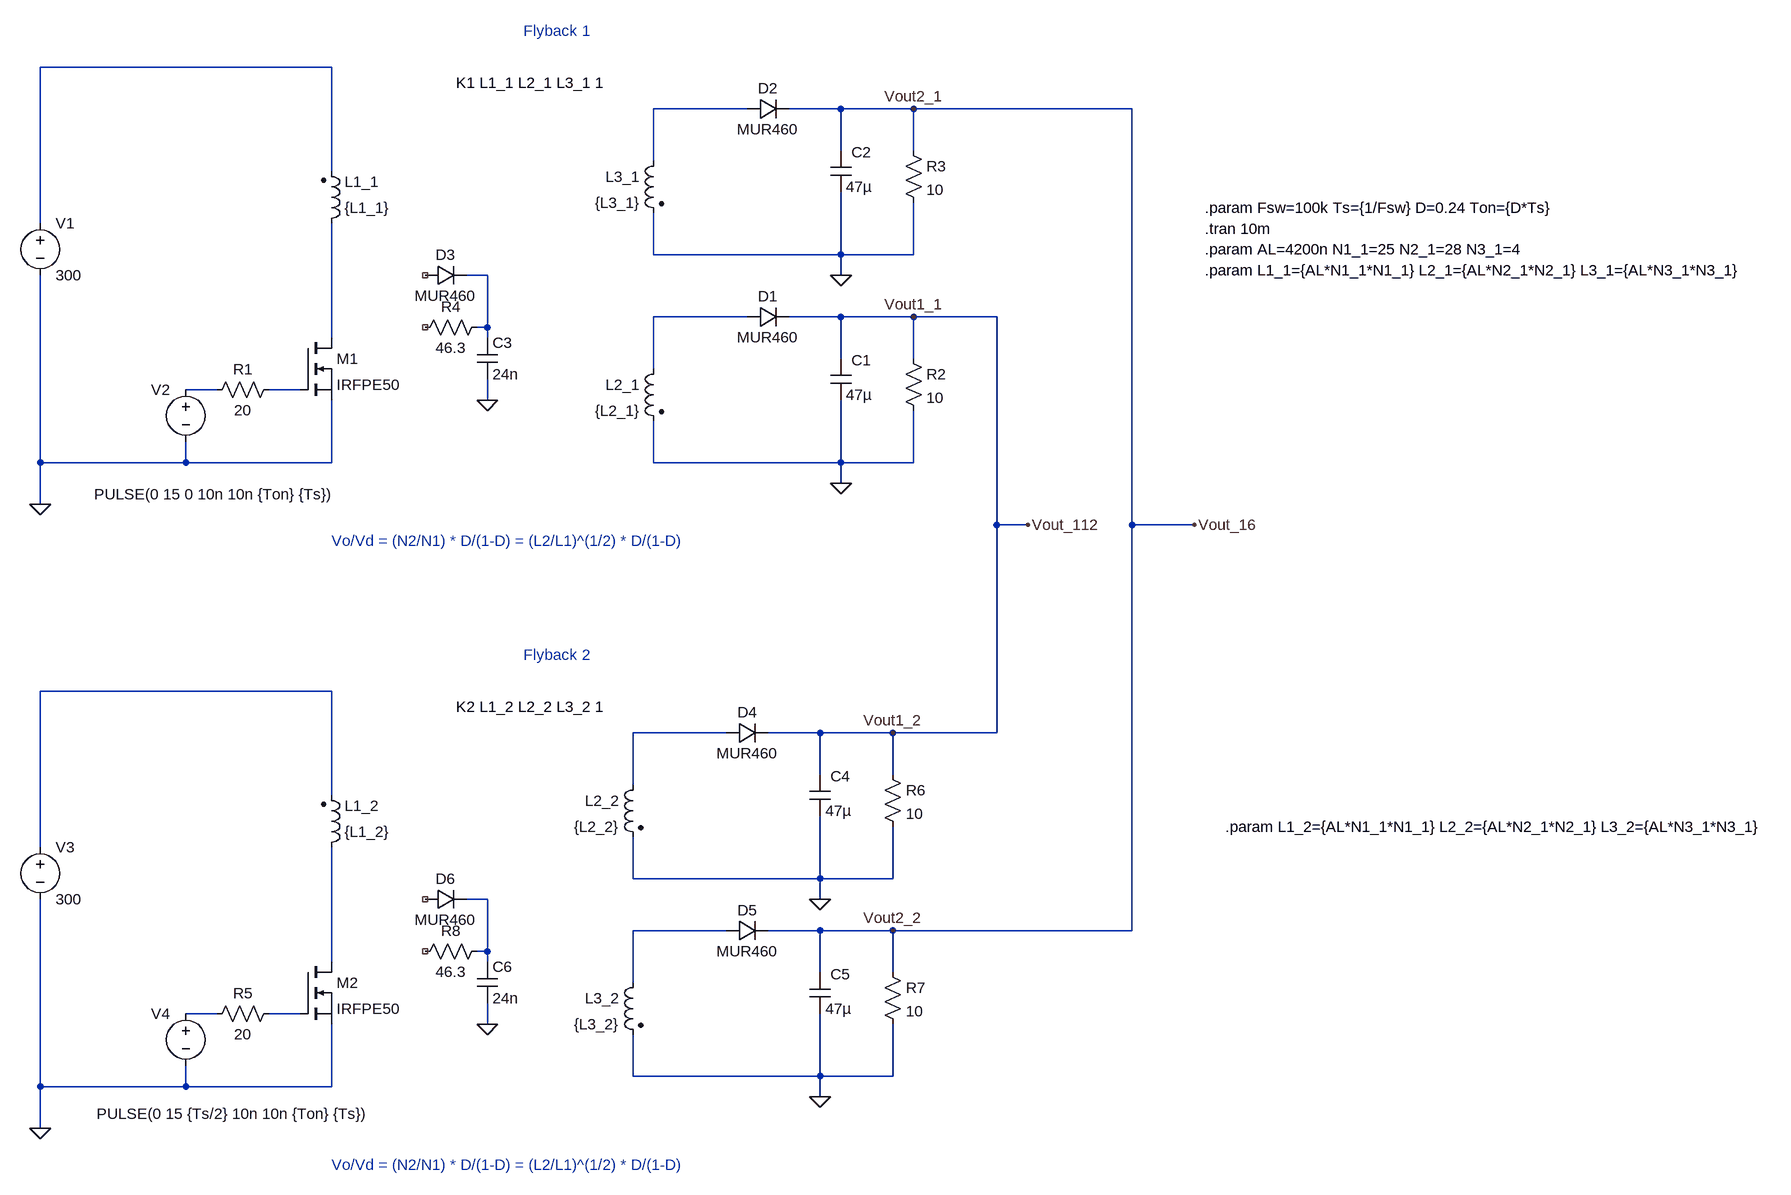
[diagram p0: schematic Flyback_2.asc]
Flyback_2.asc, the LTspice schematic file:
Version 4
SHEET 1 1892 1416
WIRE -448 -288 -896 -288
WIRE 192 -224 48 -224
WIRE 336 -224 256 -224
WIRE 448 -224 336 -224
WIRE 784 -224 448 -224
WIRE 336 -160 336 -224
WIRE 448 -160 448 -224
WIRE 48 -144 48 -224
WIRE -448 -128 -448 -288
WIRE -896 -48 -896 -288
WIRE 48 0 48 -64
WIRE 336 0 336 -96
WIRE 336 0 48 0
WIRE 448 0 448 -80
WIRE 448 0 336 0
WIRE -208 32 -240 32
WIRE 336 32 336 0
WIRE 192 96 48 96
WIRE 336 96 256 96
WIRE 448 96 336 96
WIRE 576 96 448 96
WIRE -208 112 -208 32
WIRE -208 112 -224 112
WIRE -448 128 -448 -48
WIRE -208 128 -208 112
WIRE 336 160 336 96
WIRE 448 160 448 96
WIRE 48 176 48 96
WIRE -624 208 -672 208
WIRE -496 208 -544 208
WIRE -208 224 -208 192
WIRE -896 320 -896 32
WIRE -672 320 -672 288
WIRE -672 320 -896 320
WIRE -448 320 -448 224
WIRE -448 320 -672 320
WIRE 48 320 48 256
WIRE 336 320 336 224
WIRE 336 320 48 320
WIRE 448 320 448 240
WIRE 448 320 336 320
WIRE 336 352 336 320
WIRE -896 384 -896 320
WIRE 576 416 576 96
WIRE 624 416 576 416
WIRE 784 416 784 -224
WIRE 880 416 784 416
WIRE -448 672 -896 672
WIRE 160 736 16 736
WIRE 304 736 224 736
WIRE 416 736 304 736
WIRE 576 736 576 416
WIRE 576 736 416 736
WIRE 304 800 304 736
WIRE 416 800 416 736
WIRE 16 816 16 736
WIRE -448 832 -448 672
WIRE -896 912 -896 672
WIRE 16 960 16 896
WIRE 304 960 304 864
WIRE 304 960 16 960
WIRE 416 960 416 880
WIRE 416 960 304 960
WIRE -208 992 -240 992
WIRE 304 992 304 960
WIRE 160 1040 16 1040
WIRE 304 1040 224 1040
WIRE 416 1040 304 1040
WIRE 784 1040 784 416
WIRE 784 1040 416 1040
WIRE -208 1072 -208 992
WIRE -208 1072 -224 1072
WIRE -448 1088 -448 912
WIRE -208 1088 -208 1072
WIRE 304 1104 304 1040
WIRE 416 1104 416 1040
WIRE 16 1120 16 1040
WIRE -624 1168 -672 1168
WIRE -496 1168 -544 1168
WIRE -208 1184 -208 1152
WIRE 16 1264 16 1200
WIRE 304 1264 304 1168
WIRE 304 1264 16 1264
WIRE 416 1264 416 1184
WIRE 416 1264 304 1264
WIRE -896 1280 -896 992
WIRE -672 1280 -672 1248
WIRE -672 1280 -896 1280
WIRE -448 1280 -448 1184
WIRE -448 1280 -672 1280
WIRE 304 1296 304 1264
WIRE -896 1344 -896 1280
FLAG -896 384 0
FLAG 448 96 Vout1_1
FLAG 448 -224 Vout2_1
FLAG 336 352 0
FLAG 336 32 0
FLAG -208 224 0
FLAG -896 1344 0
FLAG 416 736 Vout1_2
FLAG 416 1040 Vout2_2
FLAG 304 992 0
FLAG 304 1296 0
FLAG -208 1184 0
FLAG 624 416 Vout_112
FLAG 880 416 Vout_16
SYMBOL nmos -496 128 R0
SYMATTR InstName M1
SYMATTR Value IRFPE50
SYMBOL diode 192 112 R270
WINDOW 0 32 32 VTop 2
WINDOW 3 0 32 VBottom 2
SYMATTR InstName D1
SYMATTR Value MUR460
SYMBOL voltage -896 -64 R0
WINDOW 123 0 0 Left 0
WINDOW 39 0 0 Left 0
SYMATTR InstName V1
SYMATTR Value 300
SYMBOL res -528 192 R90
WINDOW 0 0 56 VBottom 2
WINDOW 3 32 56 VTop 2
SYMATTR InstName R1
SYMATTR Value 20
SYMBOL cap 320 160 R0
WINDOW 0 32 3 Left 2
SYMATTR InstName C1
SYMATTR Value 47µ
SYMBOL res 432 144 R0
SYMATTR InstName R2
SYMATTR Value 10
SYMBOL ind2 -464 -32 M180
WINDOW 0 36 80 Left 2
WINDOW 3 36 40 Left 2
SYMATTR InstName L1_1
SYMATTR Value {L1_1}
SYMATTR Type ind
SYMBOL ind2 64 160 M0
SYMATTR InstName L2_1
SYMATTR Value {L2_1}
SYMATTR Type ind
SYMBOL diode 192 -208 R270
WINDOW 0 32 32 VTop 2
WINDOW 3 0 32 VBottom 2
SYMATTR InstName D2
SYMATTR Value MUR460
SYMBOL cap 320 -160 R0
WINDOW 0 32 3 Left 2
SYMATTR InstName C2
SYMATTR Value 47µ
SYMBOL res 432 -176 R0
SYMATTR InstName R3
SYMATTR Value 10
SYMBOL ind2 64 -160 M0
SYMATTR InstName L3_1
SYMATTR Value {L3_1}
SYMATTR Type ind
SYMBOL diode -304 48 R270
WINDOW 0 32 32 VTop 2
WINDOW 3 0 32 VBottom 2
SYMATTR InstName D3
SYMATTR Value MUR460
SYMBOL cap -224 128 R0
SYMATTR InstName C3
SYMATTR Value 24n
SYMBOL res -208 96 R90
WINDOW 0 0 56 VBottom 2
WINDOW 3 32 56 VTop 2
SYMATTR InstName R4
SYMATTR Value 46.3
SYMBOL voltage -672 192 M0
WINDOW 123 0 0 Left 0
WINDOW 39 0 0 Left 0
WINDOW 3 -231 177 Left 2
SYMATTR InstName V2
SYMATTR Value PULSE(0 15 0 10n 10n {Ton} {Ts})
SYMBOL nmos -496 1088 R0
SYMATTR InstName M2
SYMATTR Value IRFPE50
SYMBOL diode 160 752 R270
WINDOW 0 32 32 VTop 2
WINDOW 3 0 32 VBottom 2
SYMATTR InstName D4
SYMATTR Value MUR460
SYMBOL voltage -896 896 R0
WINDOW 123 0 0 Left 0
WINDOW 39 0 0 Left 0
SYMATTR InstName V3
SYMATTR Value 300
SYMBOL res -528 1152 R90
WINDOW 0 0 56 VBottom 2
WINDOW 3 32 56 VTop 2
SYMATTR InstName R5
SYMATTR Value 20
SYMBOL cap 288 800 R0
WINDOW 0 32 3 Left 2
SYMATTR InstName C4
SYMATTR Value 47µ
SYMBOL res 400 784 R0
SYMATTR InstName R6
SYMATTR Value 10
SYMBOL ind2 -464 928 M180
WINDOW 0 36 80 Left 2
WINDOW 3 36 40 Left 2
SYMATTR InstName L1_2
SYMATTR Value {L1_2}
SYMATTR Type ind
SYMBOL ind2 32 800 M0
SYMATTR InstName L2_2
SYMATTR Value {L2_2}
SYMATTR Type ind
SYMBOL diode 160 1056 R270
WINDOW 0 32 32 VTop 2
WINDOW 3 0 32 VBottom 2
SYMATTR InstName D5
SYMATTR Value MUR460
SYMBOL cap 288 1104 R0
WINDOW 0 32 3 Left 2
SYMATTR InstName C5
SYMATTR Value 47µ
SYMBOL res 400 1088 R0
SYMATTR InstName R7
SYMATTR Value 10
SYMBOL ind2 32 1104 M0
SYMATTR InstName L3_2
SYMATTR Value {L3_2}
SYMATTR Type ind
SYMBOL diode -304 1008 R270
WINDOW 0 32 32 VTop 2
WINDOW 3 0 32 VBottom 2
SYMATTR InstName D6
SYMATTR Value MUR460
SYMBOL cap -224 1088 R0
SYMATTR InstName C6
SYMATTR Value 24n
SYMBOL res -208 1056 R90
WINDOW 0 0 56 VBottom 2
WINDOW 3 32 56 VTop 2
SYMATTR InstName R8
SYMATTR Value 46.3
SYMBOL voltage -672 1152 M0
WINDOW 123 0 0 Left 0
WINDOW 39 0 0 Left 0
WINDOW 3 -285 170 Left 2
SYMATTR InstName V4
SYMATTR Value PULSE(0 15 {Ts/2} 10n 10n {Ton} {Ts})
TEXT -448 440 Left 2 ;Vo/Vd = (N2/N1) * D/(1-D) = (L2/L1)^(1/2) * D/(1-D)
TEXT -256 -264 Left 2 !K1 L1_1 L2_1 L3_1 1
TEXT -152 -344 Left 2 ;Flyback 1
TEXT 896 -40 Left 2 !.tran 10m
TEXT 896 -72 Left 2 !.param Fsw=100k Ts={1/Fsw} D=0.24 Ton={D*Ts}
TEXT 896 -8 Left 2 !.param AL=4200n N1_1=25 N2_1=28 N3_1=4
TEXT 896 24 Left 2 !.param L1_1={AL*N1_1*N1_1} L2_1={AL*N2_1*N2_1} L3_1={AL*N3_1*N3_1}
TEXT -448 1400 Left 2 ;Vo/Vd = (N2/N1) * D/(1-D) = (L2/L1)^(1/2) * D/(1-D)
TEXT -256 696 Left 2 !K2 L1_2 L2_2 L3_2 1
TEXT -152 616 Left 2 ;Flyback 2
TEXT 928 880 Left 2 !.param L1_2={AL*N1_1*N1_1} L2_2={AL*N2_1*N2_1} L3_2={AL*N3_1*N3_1}

The netlist it stands for:
* Flyback_2.asc
M1 N005 N007 0 0 IRFPE50
D1 N004 Vout_112 MUR460
V1 N001 0 300
R1 N007 N006 20
C1 Vout_112 0 47µ
R2 Vout_112 0 10
L1_1 N005 N001 {L1_1}
L2_1 N004 0 {L2_1}
D2 N002 Vout_16 MUR460
C2 Vout_16 0 47µ
R3 Vout_16 0 10
L3_1 N002 0 {L3_1}
D3 NC_01 N003 MUR460
C3 N003 0 24n
R4 N003 NC_02 46.3
V2 N006 0 PULSE(0 15 0 10n 10n {Ton} {Ts})
M2 N012 N014 0 0 IRFPE50
D4 N009 Vout_112 MUR460
V3 N008 0 300
R5 N014 N013 20
C4 Vout_112 0 47µ
R6 Vout_112 0 10
L1_2 N012 N008 {L1_2}
L2_2 N009 0 {L2_2}
D5 N011 Vout_16 MUR460
C5 Vout_16 0 47µ
R7 Vout_16 0 10
L3_2 N011 0 {L3_2}
D6 NC_03 N010 MUR460
C6 N010 0 24n
R8 N010 NC_04 46.3
V4 N013 0 PULSE(0 15 {Ts/2} 10n 10n {Ton} {Ts})
.model D D
.lib standard.dio
.model NMOS NMOS
.model PMOS PMOS
.lib standard.mos
* Vo/Vd = (N2/N1) * D/(1-D) = (L2/L1)^(1/2) * D/(1-D)
K1 L1_1 L2_1 L3_1 1
* Flyback 1
.tran 10m
.param Fsw=100k Ts={1/Fsw} D=0.24 Ton={D*Ts}
.param AL=4200n N1_1=25 N2_1=28 N3_1=4
.param L1_1={AL*N1_1*N1_1} L2_1={AL*N2_1*N2_1} L3_1={AL*N3_1*N3_1}
* Vo/Vd = (N2/N1) * D/(1-D) = (L2/L1)^(1/2) * D/(1-D)
K2 L1_2 L2_2 L3_2 1
* Flyback 2
.param L1_2={AL*N1_1*N1_1} L2_2={AL*N2_1*N2_1} L3_2={AL*N3_1*N3_1}
.backanno
.end